# EAGLE schematic LV_cutoff (EAGLE 7.7.0)
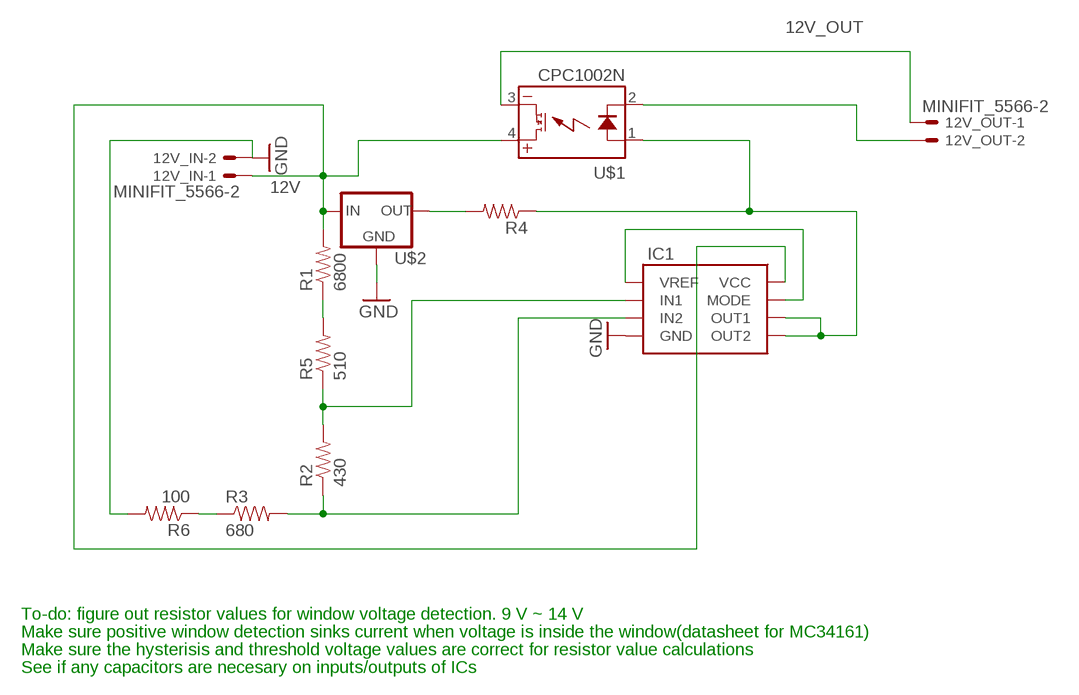
[diagram p0: schematic, sheet 1]

## Parts
12V_IN  MINIFIT_5566-2  [MINIFIT_5566-2]
12V_OUT  MINIFIT_5566-2  [MINIFIT_5566-2]
IC1  MC34161DG  [SOIC-08]
R1  6800  RESISTOR0805-RES  [0805]
R2  430  RESISTOR0805-RES  [0805]
R3  680  RESISTOR0805-RES  [0805]
R4  RESISTOR0805-RES  [0805]
R5  510  RESISTOR0805-RES  [0805]
R6  100  RESISTOR0805-RES  [0805]
U$1  CPC1002N  [SOP04]
U$2  5VREG_LM340-NLM340MPX-5.0/NOPB  [SOT223]

## Nets
12V: 12V_IN.1 IC1.8(VCC) R1.2 U$1.4(DC+) U$2.1(IN)
12V_OUT: 12V_OUT.1 U$1.3(DC-)
GND: 12V_IN.2 IC1.4(GND) R6.2 U$2.2(GND) U$2.4(GND)
N$1: IC1.5(OUT2) IC1.6(OUT1) R4.1 U$1.1(CONTROL+)
N$2: IC1.1(VREF) IC1.7(MODE)
N$3: R4.2 U$2.3(OUT)
N$4: IC1.2(IN1) R2.2 R5.1
N$5: IC1.3(IN2) R2.1 R3.2
N$7: 12V_OUT.2 U$1.2(CONTROL-)
N$8: R3.1 R6.1
N$9: R1.1 R5.2

## Notes on the sheet
- To-do: figure out resistor values for window voltage detection. 9 V ~ 14 V
- Make sure positive window detection sinks current when voltage is inside the window(datasheet for MC34161)
- Make sure the hysterisis and threshold voltage values are correct for resistor value calculations
- See if any capacitors are necesary on inputs/outputs of ICs

## Library data of the parts
12V_IN 12V_OUT = HyTechDevices:MINIFIT_5566-2: Mini-Fit Junior connector 2 pole Source: http://www.molex.com; OC_FARNELL: 1822072; OC_NEWARK: unknown
IC1 = HyTechDevices:MC34161DG: ON Semiconductor MC34161 Dual Channel Voltage Monitor
R1-R6 = HyTechDevices:RESISTOR: Resistor Basic schematic elements and footprints for 0603, 1206, and PTH resistors.
U$1 = HyTechDevices:CPC1002N: IXYS Solid State Relay .7A
U$2 = HyTechDevices:5VREG_LM340-N: Voltage Regulator 5v linear voltage regulator Datasheet <http://www.mouser.com/ProductDetail/Texas-Instruments/LM340MPX-50-NOPB/?qs=X1J7HmVL2ZGZwtTFRQ9ItA%3D%3D> MAX current out: 1.5A MAX voltage in: 35V